# EAGLE design bbedison_base (EAGLE 7.1.0)
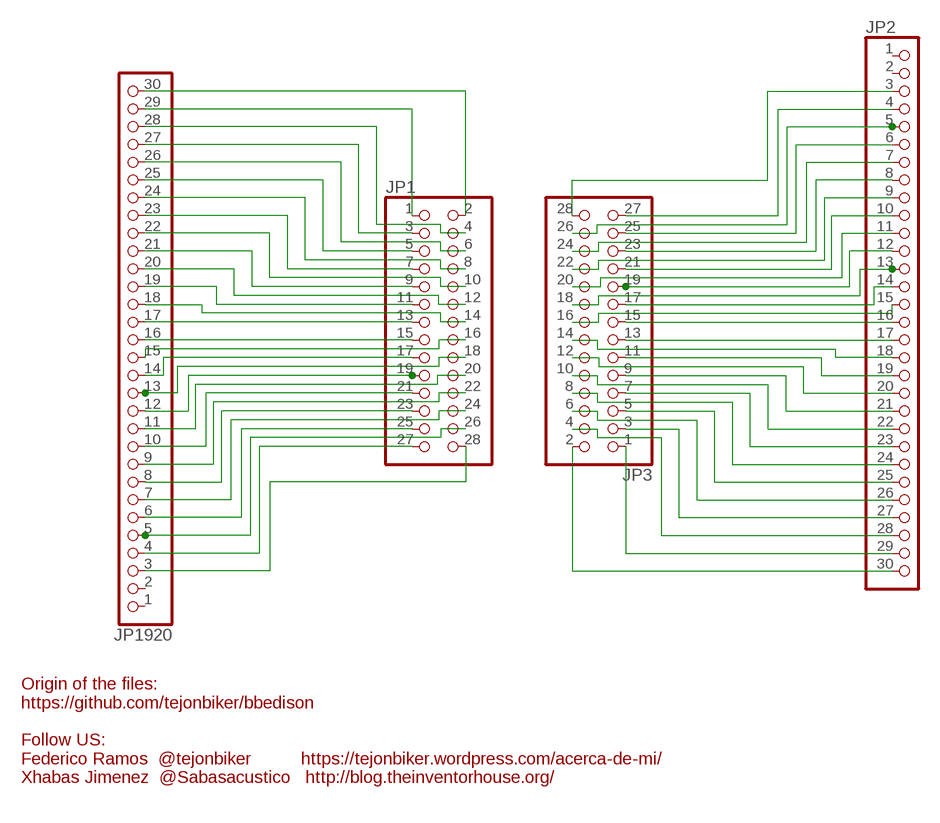
[diagram p0: schematic, sheet 1]

## Parts
JP1  PINHD-2X14  [2X14]
JP2  PINHD-1X30  [1X30]
JP3  PINHD-2X14  [2X14]
JP1920  PINHD-1X30  [1X30]

## Nets
N$1: JP1.2 JP1920.30
N$2: JP1.1 JP1920.29
N$3: JP1.4 JP1920.28
N$4: JP1.3 JP1920.27
N$5: JP1.6 JP1920.26
N$6: JP1.5 JP1920.25
N$7: JP1.8 JP1920.24
N$8: JP1.7 JP1920.23
N$9: JP1.10 JP1920.22
N$10: JP1.9 JP1920.21
N$11: JP1.12 JP1920.20
N$12: JP1.11 JP1920.19
N$13: JP1.16 JP1920.15
N$14: JP1.14 JP1920.18
N$15: JP1.13 JP1920.17
N$16: JP1.15 JP1920.16
N$17: JP1.17 JP1920.14
N$18: JP1.18 JP1920.13
N$19: JP1.19 JP1920.12
N$20: JP1.20 JP1920.11
N$21: JP1.21 JP1920.10
N$22: JP1.22 JP1920.9
N$23: JP1.23 JP1920.8
N$24: JP1.24 JP1920.7
N$25: JP1.25 JP1920.6
N$26: JP1.26 JP1920.5
N$27: JP1.27 JP1920.4
N$28: JP1.28 JP1920.3
N$29: JP2.30 JP3.2
N$30: JP2.29 JP3.1
N$31: JP2.28 JP3.4
N$32: JP2.27 JP3.3
N$33: JP2.26 JP3.6
N$34: JP2.25 JP3.5
N$35: JP2.24 JP3.8
N$36: JP2.23 JP3.7
N$37: JP2.22 JP3.10
N$38: JP2.21 JP3.9
N$39: JP2.20 JP3.12
N$40: JP2.19 JP3.11
N$41: JP2.18 JP3.14
N$42: JP2.17 JP3.13
N$43: JP2.16 JP3.15
N$44: JP2.15 JP3.16
N$45: JP2.14 JP3.17
N$46: JP2.13 JP3.18
N$47: JP2.12 JP3.19
N$48: JP2.11 JP3.20
N$49: JP2.10 JP3.21
N$50: JP2.9 JP3.22
N$51: JP2.8 JP3.23
N$52: JP2.7 JP3.24
N$53: JP2.6 JP3.25
N$54: JP2.5 JP3.26
N$55: JP2.4 JP3.27
N$56: JP2.3 JP3.28
Unconnected: JP2.1 JP2.2 JP1920.1 JP1920.2

## Notes on the sheet
- Origin of the files:
  https://github.com/tejonbiker/bbedison
  
  Follow US:
  Federico Ramos  @tejonbiker          https://tejonbiker.wordpress.com/acerca-de-mi/
  Xhabas Jimenez  @Sabasacustico   http://blog.theinventorhouse.org/

## Library data of the parts
JP1 JP3 = pinhead:PINHD-2X14: PIN HEADER
JP2 JP1920 = pinhead:PINHD-1X30: PIN HEADER

## Board
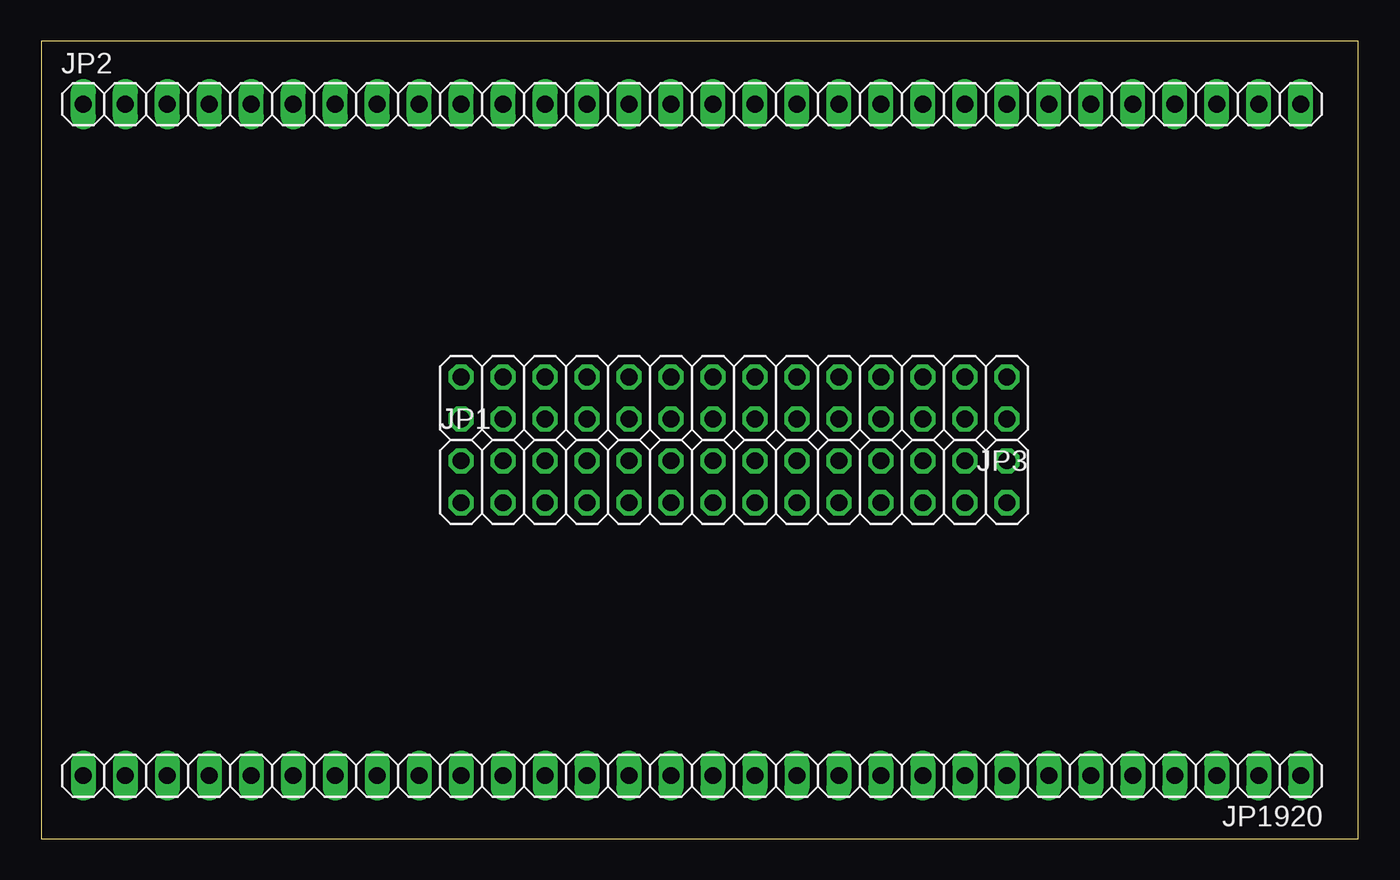
[diagram p1: board, top side]
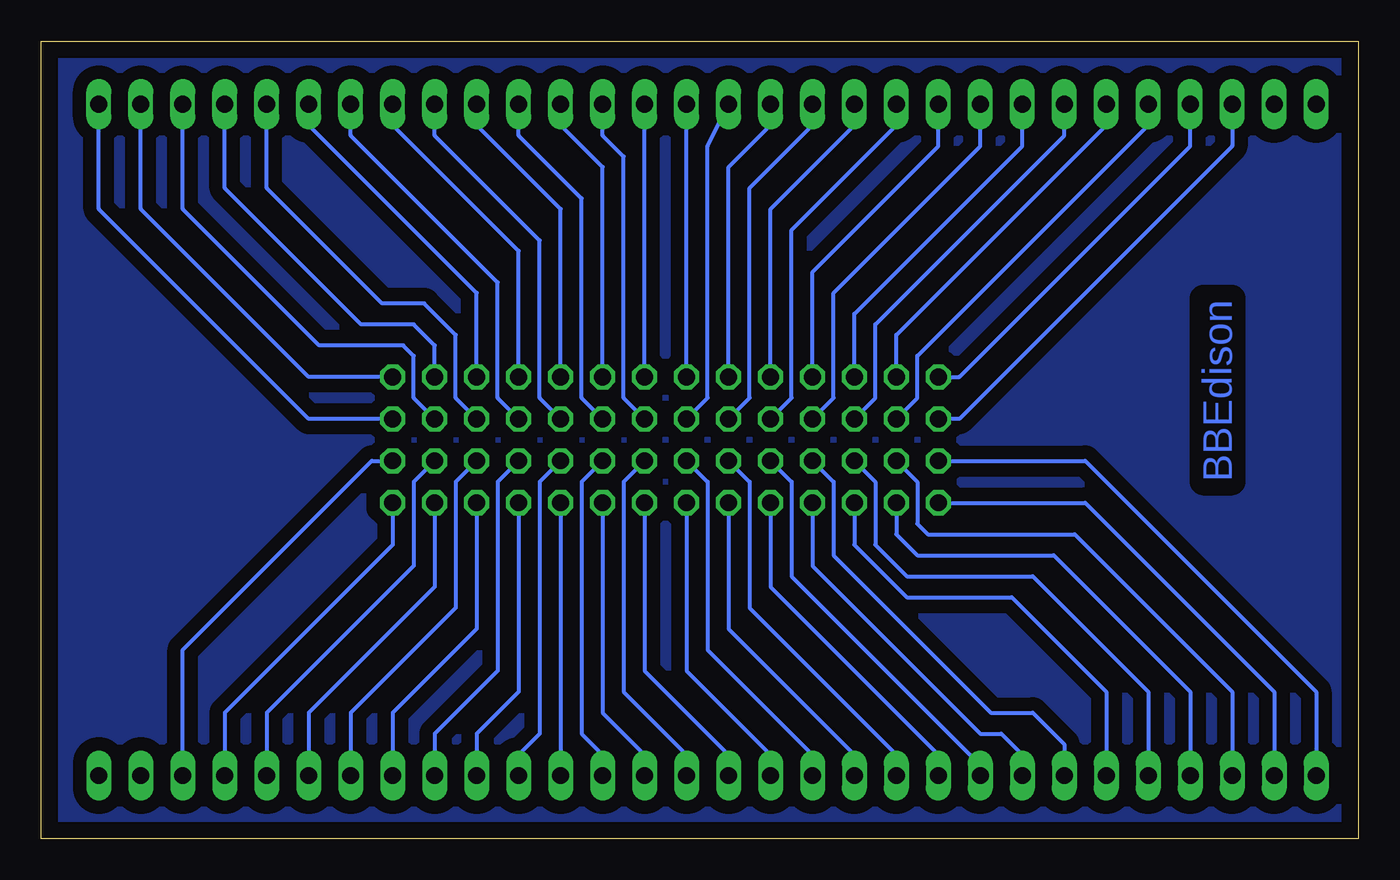
[diagram p2: board, bottom side, seen from below]

Size 79.68 x 48.25 mm. Coordinates in mm from the lower left corner, seen from the top.
Outline: 0,0 79.68,0 79.68,48.25 0,48.25 0,0
Copper layers (1*16): Top 0.035mm / dielectric 1.5mm / Bottom 0.035mm
Design rules "default": minimum track width 10mil, minimum drill 24mil, track to track 8mil, track to pad 8mil, pad to pad 8mil, via to via 8mil, smd to smd 8mil, copper to edge 40mil, drill to drill 8mil, minimum pad ring 10mil, minimum via ring 8mil, stop-mask expansion 4mil, vias tented up to drill 0mil, thermal gap 10mil

### Footprints (pad centres in the part's own frame; a part is rotated, then mirrored left to right if it is on the bottom)
2X14 = drill 1.016 octagon: 1 -16.51,-1.27; 2 -16.51,1.27; 3 -13.97,-1.27; 4 -13.97,1.27; 5 -11.43,-1.27; 6 -11.43,1.27; 7 -8.89,-1.27; 8 -8.89,1.27; 9 -6.35,-1.27; 10 -6.35,1.27; 11 -3.81,-1.27; 12 -3.81,1.27; 13 -1.27,-1.27; 14 -1.27,1.27; 15 1.27,-1.27; 16 1.27,1.27; 17 3.81,-1.27; 18 3.81,1.27; 19 6.35,-1.27; 20 6.35,1.27; 21 8.89,-1.27; 22 8.89,1.27; 23 11.43,-1.27; 24 11.43,1.27; 25 13.97,-1.27; 26 13.97,1.27; 27 16.51,-1.27; 28 16.51,1.27
1X30 = drill 1.016 long: 1 -36.83,0; 2 -34.29,0; 3 -31.75,0; 4 -29.21,0; 5 -26.67,0; 6 -24.13,0; 7 -21.59,0; 8 -19.05,0; 9 -16.51,0; 10 -13.97,0; 11 -11.43,0; 12 -8.89,0; 13 -6.35,0; 14 -3.81,0; 15 -1.27,0; 16 1.27,0; 17 3.81,0; 18 6.35,0; 19 8.89,0; 20 11.43,0; 21 13.97,0; 22 16.51,0; 23 19.05,0; 24 21.59,0; 25 24.13,0; 26 26.67,0; 27 29.21,0; 28 31.75,0; 29 34.29,0; 30 36.83,0

### Placement (x,y rotation side)
JP1  41.91,21.59 0 top
JP2  39.37,44.45 0 top
JP3  41.91,26.67 180 top
JP1920  39.37,3.81 180 top

### Tracks (layer width: path | path; a pad name or v marks a point on that pad's centre or on a via)
N$1
  Bottom 0.254: JP1.2 16.51,22.86 2.54,8.89 JP1920.30
N$2
  Bottom 0.254: JP1.1 16.51,20.32 5.08,8.89 JP1920.29
N$3
  Bottom 0.254: JP1.4 26.67,21.59 26.67,19.05 26.03,18.41 17.14,18.41 7.62,8.89 JP1920.28
N$4
  Bottom 0.254: JP1.3 27.94,18.41 26.67,17.14 18.41,17.14 10.16,8.89 JP1920.27
N$5
  Bottom 0.254: JP1.6 29.21,21.59 29.21,17.78 27.3,15.87 19.69,15.87 12.7,8.89 JP1920.26
N$6
  Bottom 0.254: JP1.5 30.48,17.78 27.3,14.6 20.95,14.6 15.24,8.89 JP1920.25
N$7
  Bottom 0.254: JP1.8 31.75,21.59 31.75,17.14 22.23,7.62 19.69,7.62 17.78,5.71 JP1920.24
  Bottom 0.406: JP1920.24 17.78,5.08
N$8
  Bottom 0.254: JP1.7 33.02,16.51 22.86,6.35 21.59,6.35 20.32,5.08 JP1920.23
N$9
  Bottom 0.254: JP1.10 34.29,21.59 34.29,15.87 22.86,4.44 JP1920.22
N$10
  Bottom 0.254: JP1.9 35.56,15.24 25.4,5.08 JP1920.21
N$11
  Bottom 0.254: JP1.12 36.83,21.59 36.83,13.97 27.94,5.08 JP1920.20
N$12
  Bottom 0.254: JP1.11 38.1,12.7 30.48,5.08 JP1920.19
N$13
  Bottom 0.254: JP1.16 44.45,21.59 44.45,8.89 40.64,5.08 JP1920.15
N$14
  Bottom 0.254: JP1.14 39.37,21.59 39.37,11.43 33.02,5.08 JP1920.18
N$15
  Bottom 0.254: JP1.13 40.64,10.16 35.56,5.08 JP1920.17
N$16
  Bottom 0.254: JP1.15 43.18,10.16 38.1,5.08 JP1920.16
N$17
  Bottom 0.254: JP1.17 45.72,7.62 43.18,5.08 JP1920.14
N$18
  Bottom 0.254: JP1.18 46.99,21.59 46.99,6.35 45.72,5.08 JP1920.13
N$19
  Bottom 0.254: JP1.19 JP1920.12
N$20
  Bottom 0.254: JP1.20 49.53,21.59 49.53,6.35 50.8,5.08 JP1920.11
N$21
  Bottom 0.254: JP1.21 50.8,8.89 53.34,6.35 JP1920.10
N$22
  Bottom 0.254: JP1.22 52.07,21.59 52.07,10.16 55.88,6.35 JP1920.9
N$23
  Bottom 0.254: JP1.23 53.34,12.7 58.42,7.62 JP1920.8
N$24
  Bottom 0.254: JP1.24 54.61,21.59 54.61,13.97 60.96,7.62 JP1920.7
N$25
  Bottom 0.254: JP1.25 55.88,15.24 63.5,7.62 JP1920.6
N$26
  Bottom 0.254: JP1.26 57.15,21.59 57.15,16.51 66.04,7.62 JP1920.5
N$27
  Bottom 0.254: JP1.27 58.42,17.78 68.58,7.62 JP1920.4
N$28
  Bottom 0.254: JP1920.3 71.12,11.43 59.69,22.86 JP1.28
N$29
  Bottom 0.254: JP3.2 63.5,25.4 76.2,38.1 JP2.30
N$30
  Bottom 0.254: JP3.1 63.5,27.94 73.66,38.1 JP2.29
N$31
  Bottom 0.254: JP3.4 57.15,26.67 57.15,29.21 57.78,29.84 62.86,29.84 71.12,38.1 JP2.28
N$32
  Bottom 0.254: JP3.3 55.88,29.84 57.15,31.11 60.33,31.11 68.58,39.37 JP2.27
N$33
  Bottom 0.254: JP3.6 54.61,26.67 54.61,30.48 56.52,32.38 59.05,32.38 66.04,39.37 JP2.26
N$34
  Bottom 0.254: JP3.5 53.34,33.02 63.5,43.18 JP2.25
N$35
  Bottom 0.254: JP3.8 52.07,26.67 52.07,33.66 60.96,42.54 JP2.24
N$36
  Bottom 0.254: JP3.7 50.8,35.56 58.42,43.18 JP2.23
N$37
  Bottom 0.254: JP3.10 49.53,26.67 49.53,36.2 55.88,42.54 JP2.22
N$38
  Bottom 0.254: JP3.9 48.26,38.1 53.34,43.18 JP2.21
N$39
  Bottom 0.254: JP3.12 46.99,26.67 46.99,38.73 50.8,42.54 JP2.20
N$40
  Bottom 0.254: JP3.11 45.72,40.64 48.26,43.18 JP2.19
N$41
  Bottom 0.254: JP3.14 44.45,26.67 44.45,41.27 45.72,42.54 JP2.18
N$42
  Bottom 0.254: JP3.13 JP2.17
N$43
  Bottom 0.254: JP3.15 JP2.16
N$44
  Bottom 0.254: JP3.16 39.37,26.67 39.37,41.91 JP2.15
N$45
  Bottom 0.254: JP3.17 38.1,40.64 35.56,43.18 JP2.14
N$46
  Bottom 0.254: JP3.18 36.83,26.67 36.83,39.37 33.02,43.18 JP2.13
N$47
  Bottom 0.254: JP3.19 35.56,38.1 30.48,43.18 JP2.12
N$48
  Bottom 0.254: JP3.20 34.29,26.67 34.29,36.83 27.94,43.18 JP2.11
N$49
  Bottom 0.254: JP3.21 33.02,34.29 25.4,41.91 JP2.10
N$50
  Bottom 0.254: JP3.22 31.75,26.67 31.75,33.02 22.86,41.91 JP2.9
N$51
  Bottom 0.254: JP3.23 30.48,31.75 20.32,41.91 JP2.8
N$52
  Bottom 0.254: JP3.24 29.21,26.67 29.21,31.11 17.78,42.54 JP2.7
N$53
  Bottom 0.254: JP3.25 27.94,30.48 15.24,43.18 JP2.6
N$54
  Bottom 0.254: JP3.26 26.67,26.67 26.67,29.21 12.7,43.18 JP2.5
N$55
  Bottom 0.254: JP3.27 24.13,27.94 10.16,41.91 JP2.4
N$56
  Bottom 0.254: JP2.3 7.62,41.91 24.13,25.4 JP3.28
S$1
  pour Bottom (isolate 0.813): 0,0 79.38,0 80.01,48.26 0,48.26

### Text on the board
Bottom: BBEdison